# Altium schematic sheet LEGEND.SchDoc: =DocumentName
size A4; Organization: Queen's Formula SAE; Address1: 130 Stuart St, Kingston; Address2: Ontario; Address3: Canada; Address4: K7L 2V9; DocumentNumber: 1; Revision: 0; SheetNumber: 1; SheetTotal: 1
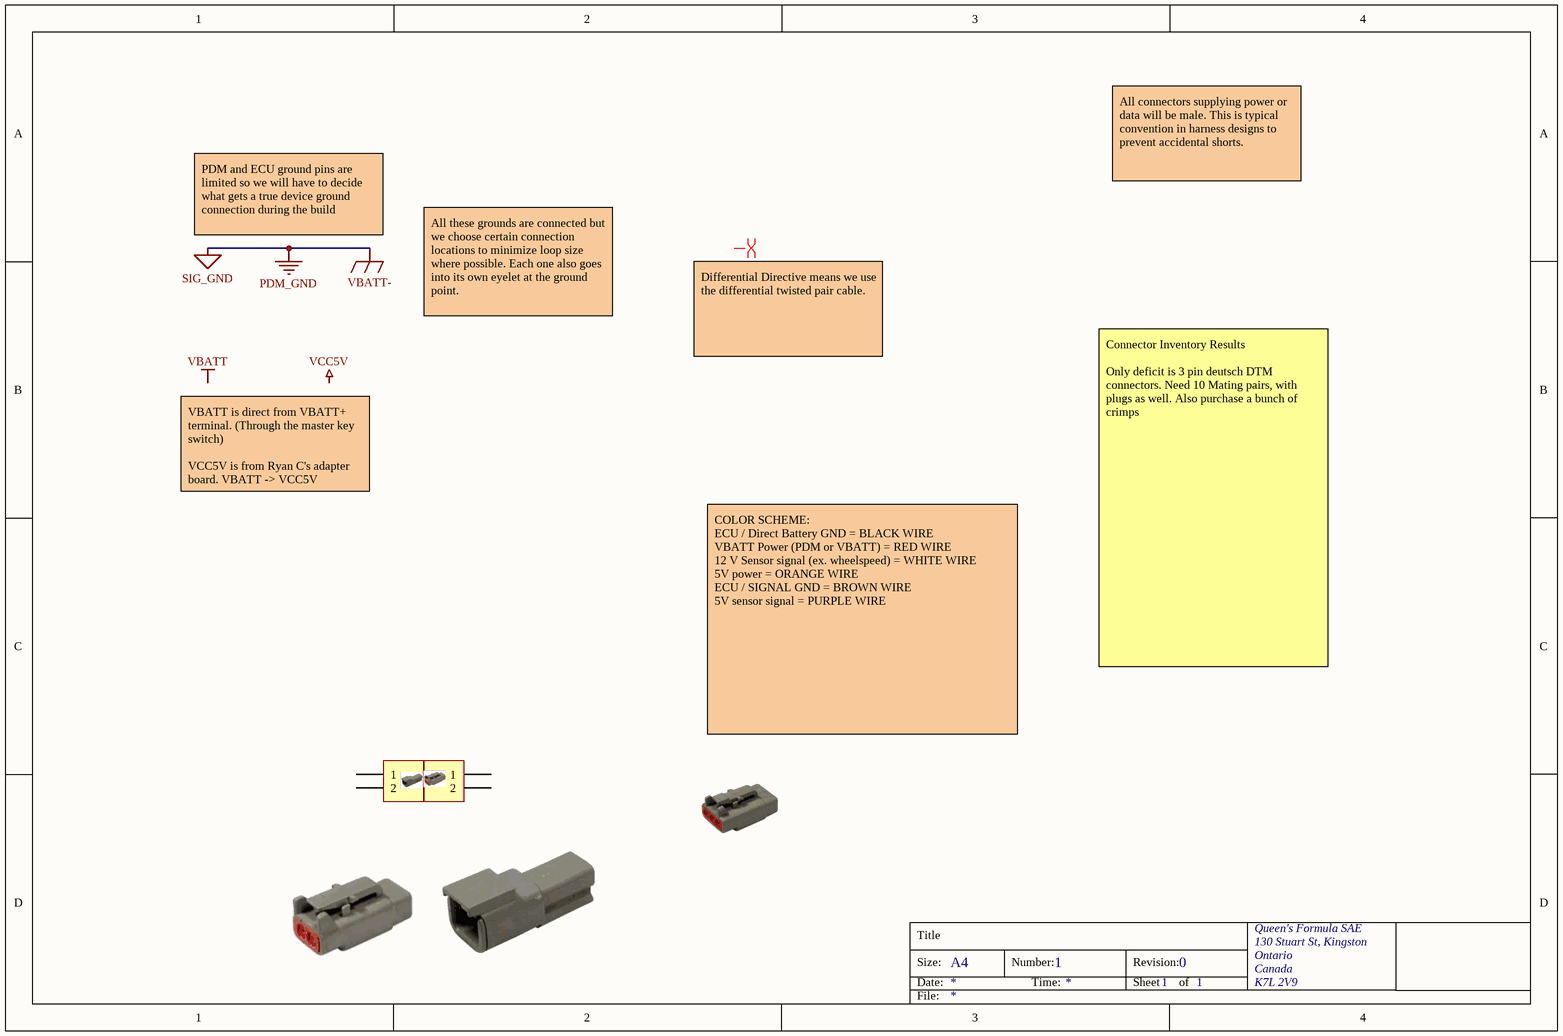
[diagram p0: LEGEND.SchDoc]

## Parts
(Parts that share a designator on the sheet are numbered #1, #2 ... from top to bottom, then left to right.)
ECU_CAN_CONNECTOR?#1  Header 2  [HDR1X2]  (value not drawn)
ECU_CAN_CONNECTOR?#2  Header 2  [HDR1X2]  (value not drawn)

## Nets

Not connected (* = marked no-connect by the designer): ECU_CAN_CONNECTOR?#1 1 2; ECU_CAN_CONNECTOR?#2 1 2

## Layout directives
differential pair: (no net found under the mark)

## Notes on the sheet
- All connectors supplying power or data will be male. This is typical convention in harness designs to prevent accidental shorts.
- PDM and ECU ground pins are limited so we will have to decide what gets a true device ground connection during the build
- All these grounds are connected but we choose certain connection locations to minimize loop size where possible. Each one also goes into its own eyelet at the ground point.
- Differential Directive means we use the differential twisted pair cable.
- VBATT is direct from VBATT+ terminal. (Through the master key switch)
  VCC5V is from Ryan C's adapter board. VBATT -> VCC5V regulator
- Connector Inventory Results
  Only deficit is 3 pin deutsch DTM connectors. Need 10 Mating pairs, with plugs as well. Also purchase a bunch of crimps
- COLOR SCHEME:
  ECU / Direct Battery GND = BLACK WIRE
  VBATT Power (PDM or VBATT) = RED WIRE
  12 V Sensor signal (ex. wheelspeed) = WHITE WIRE
  5V power = ORANGE WIRE
  ECU / SIGNAL GND = BROWN WIRE
  5V sensor signal = PURPLE WIRE
- Labels drawn without touching a wire or pin: VBATT, VCC5V
- Title
- Size:
- Date:
- A4
- Number:
- Time:
- Revision:
- Sheet
- of
- File:

## Library data of the parts
ECU_CAN_CONNECTOR?#1 ECU_CAN_CONNECTOR?#2 = Header 2: Header, 2-Pin; LatestRevisionDate: 17-Jul-2002; LatestRevisionNote: Re-released for DXP Platform.; Publisher: Altium Limited